# EAGLE schematic H-Bridge-HP (EAGLE 7.6.0)
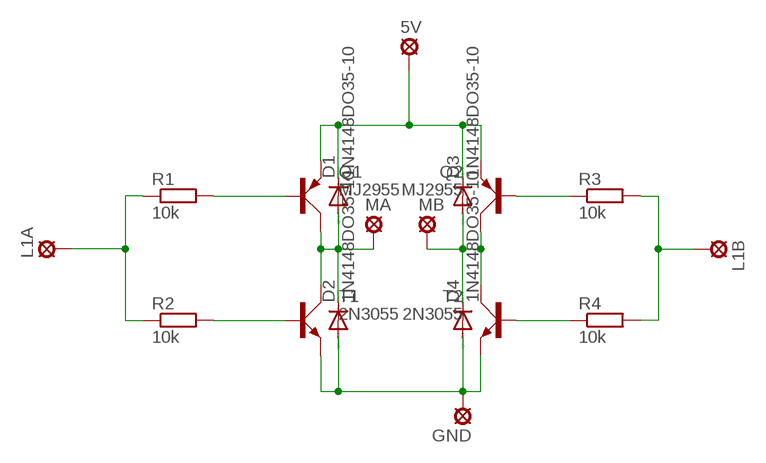
[diagram p0: schematic, sheet 1]

## Parts
5V  LSP10  [LSP10]
D1  1N4148DO35-10  [DO35-10]
D2  1N4148DO35-10  [DO35-10]
D3  1N4148DO35-10  [DO35-10]
D4  1N4148DO35-10  [DO35-10]
GND  LSP10  [LSP10]
L1A  LSP10  [LSP10]
L1B  LSP10  [LSP10]
MA  LSP10  [LSP10]
MB  LSP10  [LSP10]
Q1  MJ2955  [TO3A]
Q2  MJ2955  [TO3A]
R1  10k  R-EU_0309/12  [0309/12]
R2  10k  R-EU_0309/12  [0309/12]
R3  10k  R-EU_0309/12  [0309/12]
R4  10k  R-EU_0309/12  [0309/12]
T1  2N3055  [TO3A]
T2  2N3055  [TO3A]

## Nets
N$1: L1A.MP R1.1 R2.1
N$2: Q1.B R1.2
N$3: R2.2 T1.B
N$4: D1.A D2.C MA.MP Q1.C Q1.C1(C) T1.C T1.C1(C)
N$5: D3.A D4.C MB.MP Q2.C Q2.C1(C) T2.C T2.C1(C)
N$6: Q2.B R3.1
N$7: R4.1 T2.B
N$8: L1B.MP R3.2 R4.2
N$9: D2.A D4.A GND.MP T1.E T2.E
N$10: 5V.MP D1.C D3.C Q1.E Q2.E

## Library data of the parts
5V GND L1A L1B MA MB = solpad:LSP10: SOLDER PAD drill 1.0 mm, distributor Buerklin, 12H555
D1-D4 = diode:1N4148: DIODE high speed (Philips)
Q1 Q2 = transistor-power:MJ2955: PNP TRANSISTOR
R1-R4 = rcl:R-EU_: RESISTOR, European symbol
T1 T2 = transistor-power:2N3055: NPN TRANSISTOR